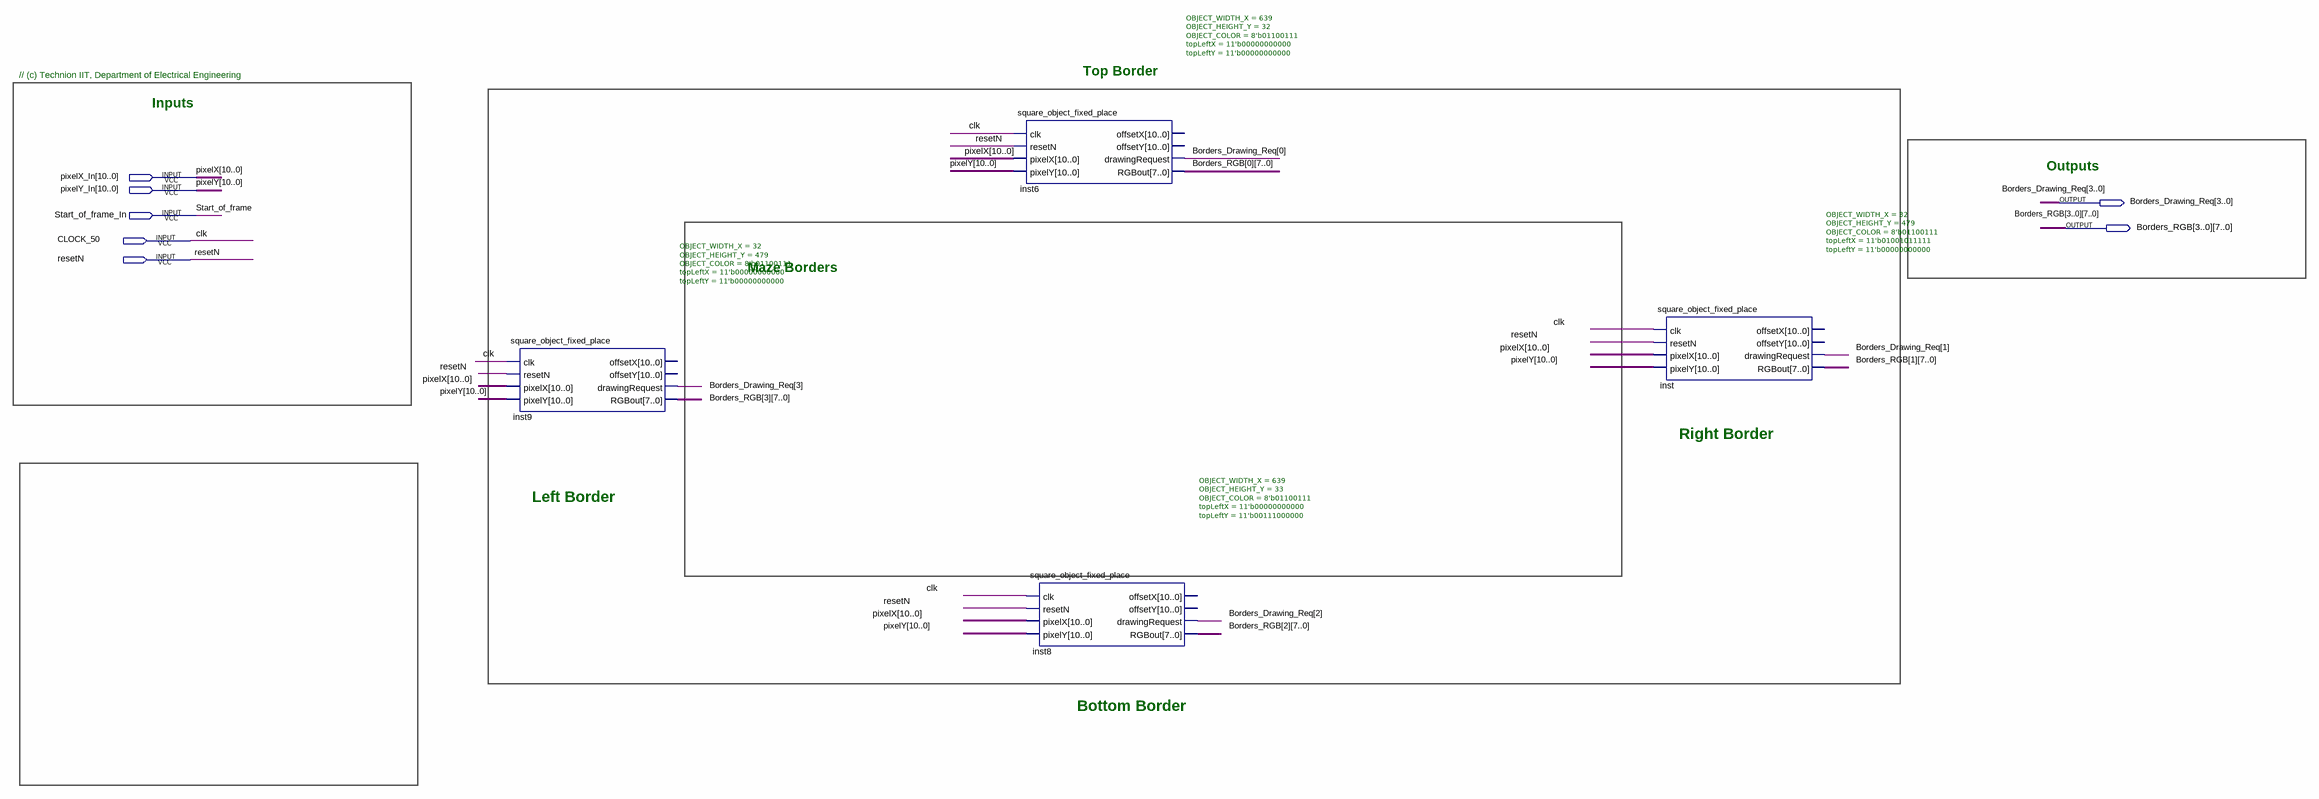
[diagram p0: schematic sheet]
// Quartus schematic Top_Maze.bdf as structural Verilog: 4 symbols, 7 pins
module Top_Maze (
  input  [10:0] pixelX_In,
  input  [10:0] pixelY_In,
  input  Start_of_frame_In,
  input  CLOCK_50,
  input  resetN,
  output [3:0] Borders_Drawing_Req,
  output [7:0] Borders_RGB_3,
  output [7:0] Borders_RGB_2,
  output [7:0] Borders_RGB_1,
  output [7:0] Borders_RGB_0
);

  square_object_fixed_place #(.OBJECT_WIDTH_X(32), .OBJECT_HEIGHT_Y(479), .OBJECT_COLOR(8'b01100111), .topLeftX(11'b00000000000), .topLeftY(11'b00000000000)) inst9 (
    .clk(CLOCK_50), .resetN(resetN), .pixelX(pixelX_In), .pixelY(pixelY_In),
    .drawingRequest(Borders_Drawing_Req[3]), .RGBout(Borders_RGB_3));  // open: offsetX, offsetY
  square_object_fixed_place #(.OBJECT_WIDTH_X(639), .OBJECT_HEIGHT_Y(32), .OBJECT_COLOR(8'b01100111), .topLeftX(11'b00000000000), .topLeftY(11'b00000000000)) inst6 (
    .clk(CLOCK_50), .resetN(resetN), .pixelX(pixelX_In), .pixelY(pixelY_In),
    .drawingRequest(Borders_Drawing_Req[0]), .RGBout(Borders_RGB_0));  // open: offsetX, offsetY
  square_object_fixed_place #(.OBJECT_WIDTH_X(639), .OBJECT_HEIGHT_Y(33), .OBJECT_COLOR(8'b01100111), .topLeftX(11'b00000000000), .topLeftY(11'b00111000000)) inst8 (
    .clk(CLOCK_50), .resetN(resetN), .pixelX(pixelX_In), .pixelY(pixelY_In),
    .drawingRequest(Borders_Drawing_Req[2]), .RGBout(Borders_RGB_2));  // open: offsetX, offsetY
  square_object_fixed_place #(.OBJECT_WIDTH_X(32), .OBJECT_HEIGHT_Y(479), .OBJECT_COLOR(8'b01100111), .topLeftX(11'b01001011111), .topLeftY(11'b00000000000)) inst (
    .clk(CLOCK_50), .resetN(resetN), .pixelX(pixelX_In), .pixelY(pixelY_In),
    .drawingRequest(Borders_Drawing_Req[1]), .RGBout(Borders_RGB_1));  // open: offsetX, offsetY

  // Other names for the same wires on the sheet: clk = CLOCK_50; pixelX[10:0] = pixelX_In; pixelY[10:0] = pixelY_In;
  //   Start_of_frame = Start_of_frame_In

  // Notes on the sheet:
  //   Top Border
  //   // (c) Technion IIT, Department of Electrical Engineering 
  //   Inputs
  //   Outputs
  //   Maze Borders
  //   Right Border
  //   Left Border
  //   Bottom Border
endmodule
